# Altium schematic sheet SDRAM.SchDoc: SDRAM 64Mbits
size A4; Date: Not used; ApprovedBy: Not used; CheckedBy: Not used; Author: Not used; CompanyName: STMicroelectronics; DrawnBy: Not used; Engineer: Not used; Organization: Not used; Address1: Not used; Address2: Not used; Address3: Not used; Address4: Not used; Revision: Not used; SheetNumber: 4; SheetTotal: 8; CurrentTime: Not used; CurrentDate: Not used; Time: Not used; DocumentFullPathAndName: Not used; DocumentName: Not used; ModifiedDate: Not used; ImagePath: Not used; ProjectName: Not used; Application_BuildNumber: Not used
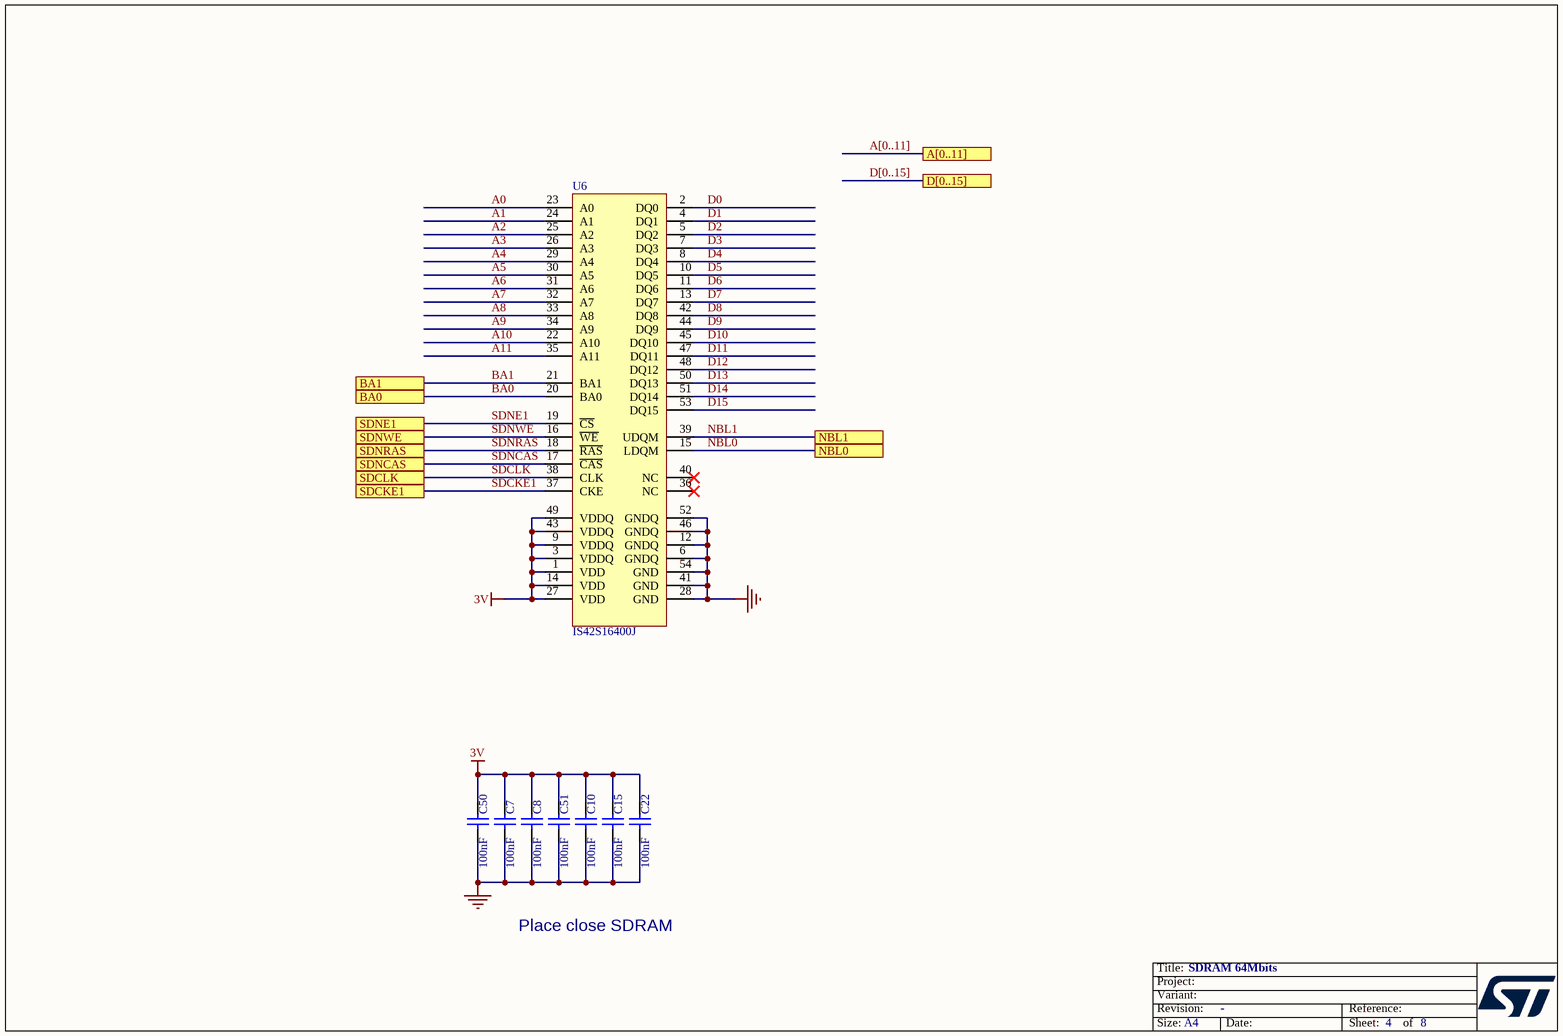
[diagram p0: SDRAM.SchDoc]

## Parts
C7  100nF  [0402C]
C8  100nF  [0402C]
C10  100nF  [0402C]
C15  100nF  [0402C]
C22  100nF  [0402C]
C50  100nF  [0402C]
C51  100nF  [0402C]
U6  IS42S16400J  [TSOP54-II]

## Ports
A[0..11], BA0, BA1, D[0..15], NBL0, NBL1, SDCKE1, SDCLK, SDNCAS, SDNE1, SDNRAS, SDNWE

## Nets
3V: C7.2 C8.2 C10.2 C15.2 C22.2 C50.2 C51.2 U6.1(VDD) U6.3(VDDQ) U6.9(VDDQ) U6.14(VDD) U6.27(VDD) U6.43(VDDQ) U6.49(VDDQ)
GND: C7.1 C8.1 C10.1 C15.1 C22.1 C50.1 C51.1 U6.6(GNDQ) U6.12(GNDQ) U6.28(GND) U6.41(GND) U6.46(GNDQ) U6.52(GNDQ) U6.54(GND)
A0: U6.23(A0)
A1: U6.24(A1)
A2: U6.25(A2)
A3: U6.26(A3)
A4: U6.29(A4)
A5: U6.30(A5)
A6: U6.31(A6)
A7: U6.32(A7)
A8: U6.33(A8)
A9: U6.34(A9)
A10: U6.22(A10)
A11: U6.35(A11)
BA0: U6.20(BA0) ; port BA0
BA1: U6.21(BA1) ; port BA1
D0: U6.2(DQ0)
D1: U6.4(DQ1)
D2: U6.5(DQ2)
D3: U6.7(DQ3)
D4: U6.8(DQ4)
D5: U6.10(DQ5)
D6: U6.11(DQ6)
D7: U6.13(DQ7)
D8: U6.42(DQ8)
D9: U6.44(DQ9)
D10: U6.45(DQ10)
D11: U6.47(DQ11)
D12: U6.48(DQ12)
D13: U6.50(DQ13)
D14: U6.51(DQ14)
D15: U6.53(DQ15)
NBL0: U6.15(LDQM) ; port NBL0
NBL1: U6.39(UDQM) ; port NBL1
SDCKE1: U6.37(CKE) ; port SDCKE1
SDCLK: U6.38(CLK) ; port SDCLK
SDNCAS: U6.17(~{CAS}) ; port SDNCAS
SDNE1: U6.19(~{CS}) ; port SDNE1
SDNRAS: U6.18(~{RAS}) ; port SDNRAS
SDNWE: U6.16(~{WE}) ; port SDNWE

Not connected (* = marked no-connect by the designer): U6 36(NC)* 40(NC)*

## Buses and harness runs
bus A[0..11] = port A[0..11]
bus D[0..15] = port D[0..15]

## Notes on the sheet
- Place close SDRAM
- Title:
- Project:
- Size:
- Revision:
- Variant:
- A4
- -
- Date:
- Reference:
- Sheet:
- of

## Library data of the parts
C7 C8 C10 C15 C22 C50 C51 = Capacitor_ST: Capacitor 0402 / 0603 / 0805; Revision: July-2002: Re-released for DXP Platform.; Value: 100nF
U6 = IS45S16400J: SYNCHRONOUS DYNAMIC RAM, 1 Meg Bits x 16 Bits x 4 Banks (64-MBIT); Manuf_1: ISSI; Order: IS42S16400J-7TL; ECCN_US/EU: EAR99/NEC; Distrib: *; Manuf_Part_1: IS42S16400J-7TL; Ref St: *